# Altium project power.PrjPcb (part 2 of 3)
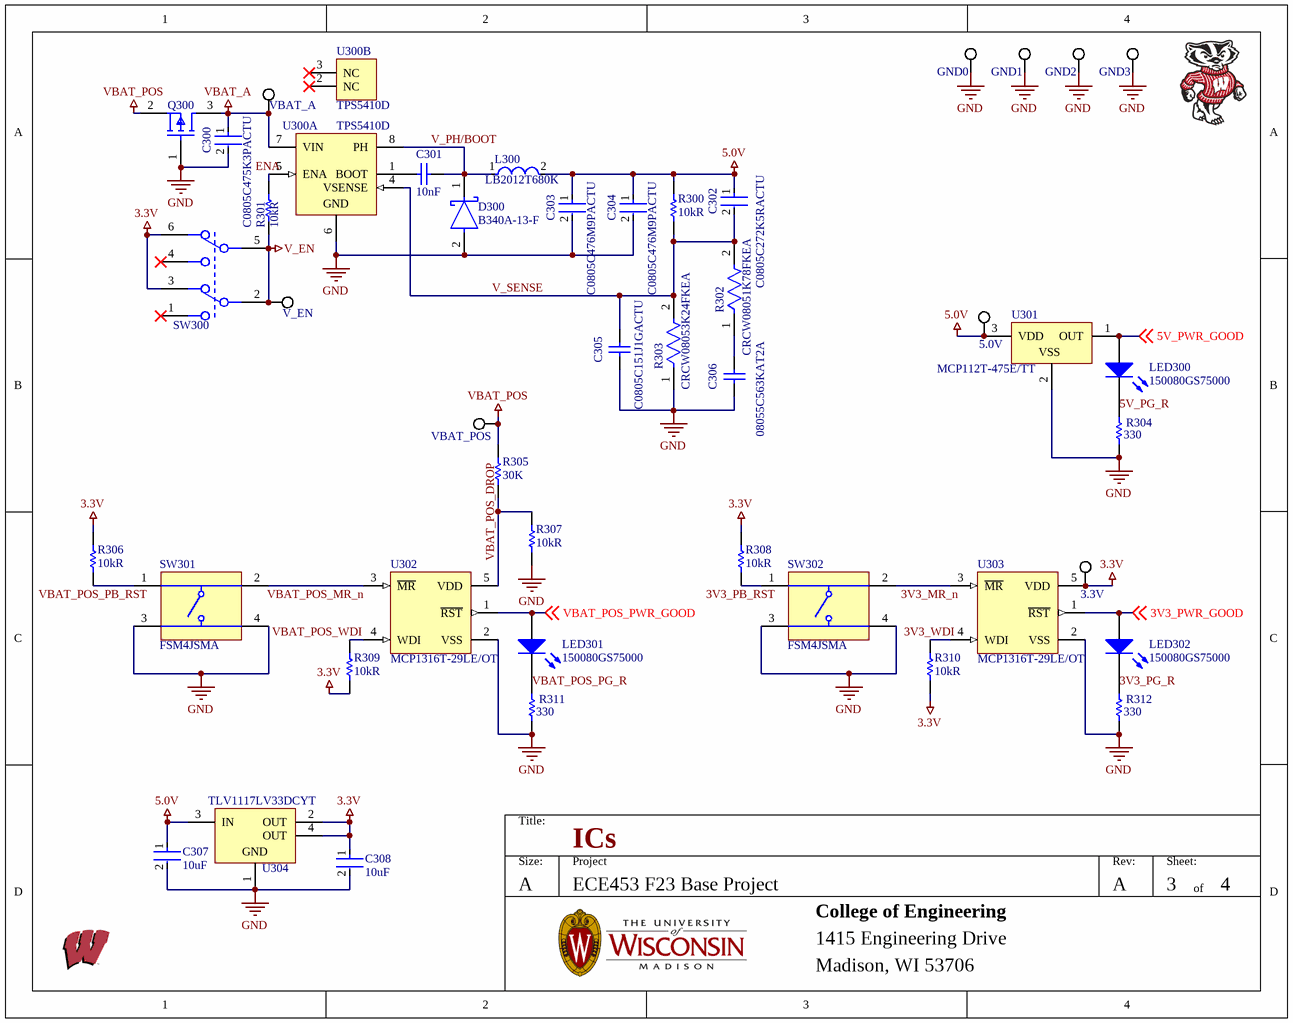
[diagram p3: 03_ICs.SchDoc]

## Sheet 03_ICs.SchDoc: ICs (continued)
### Library data of the parts
3.3V 5.0V GND0-GND3 V_EN VBAT_A VBAT_POS = CMP-1672-00008-1: Test Point, 1 Position SMD, RoHS, Tape and Reel; Manufacturer: Keystone Electronics; Plating: Silver; Body Material: Bronze; Supplier: Newark; Supplier Part Number: 59Y8500; Manufacturer Part Number: 5019; RoHS: Yes; Category: Connectors; Stock: 11269; Pricing: 1=0.411, 10=0.389, 25=0.285, 50=0.279, 100=0.273, 250=0.246 (USD); Mounting Technology: Surface Mount,PCB; Pins: 1; Contact Plating: Silver; Contact Material: Bronze; Material: Bronze; Packaging: Tape and Reel; Package Quantity: 1; Termination: SMD/SMT; Series: 5019; Height: 0.09inch; Reach SVHC Compliant: No; RoHS Compliant: Yes; Lead Free: Lead Free; ComponentLink1URL: https://datasheet.ciiva.com/14848/m60-2p61-14848437.pdf?src-supplier=Digi-Key; ComponentLink1Description: https://datasheet.ciiva.com/14848/m60-2p61-14848437.pdf?src-supplier=Digi-Key; ComponentLink2URL: https://datasheet.ciiva.com/14848/m60-2p61-14848438.pdf?src-supplier=Digi-Key; ComponentLink2Description: https://datasheet.ciiva.com/14848/m60-2p61-14848438.pdf?src-supplier=Digi-Key; ComponentLink3URL: https://datasheet.ciiva.com/14848/m60-2p61-14848439.pdf?src-supplier=Digi-Key; ComponentLink3Description: https://datasheet.ciiva.com/14848/m60-2p61-14848439.pdf?src-supplier=Digi-Key; ComponentLink4URL: https://datasheet.ciiva.com/16318/m60-2p61-16318395.pdf?src-supplier=Future+Electronics; ComponentLink4Description: https://datasheet.ciiva.com/16318/m60-2p61-16318395.pdf?src-supplier=Future+Electronics; ComponentLink5URL: https://datasheet.ciiva.com/16885/70182998-16885945.pdf?src-supplier=Allied+Electronics; ComponentLink5Description: https://datasheet.ciiva.com/16885/70182998-16885945.pdf?src-supplier=Allied+Electronics
C300 = CMP-2007-01010-2: CAP CER 4.7UF 25V X5R 0805; Manufacturer: KEMET; Tolerance: 10%; Dielectric Material: Ceramic; Dissipation Factor: 5%; Multilayer: Yes; Length: 2mm; Number of Pins: 2; Voltage Rating (DC): 25V; Depth: 1.25mm; Min Operating Temperature: -55°C; Capacitance: 4.7uF; Series: C0805C; Lead Free: Lead Free; Dielectric: X5R; REACH SVHC: No SVHC; Termination: SMD/SMT; Mount: PCB; Package Quantity: 2500; Contact Plating: Tin; Case Code (Imperial): 0805; Max Operating Temperature: 85°C; Width: 1.2mm; Voltage: 25V; Case/Package: 0805; Packaging: Tape and Reel; Height: 1.25mm; RoHS Compliant: Yes; Construction: Flat; Case Code (Metric): 2012; Radiation Hardening: No; Supplier: Digi-Key; Supplier Part Number: 399-C0805C475K3PAC7800CT-ND; Manufacturer Part Number: C0805C475K3PACTU; RoHS: Yes; Category: Ceramic Capacitors; Stock: 419470; Pricing: 1=0.29, 10=0.198, 50=0.1388, 100=0.1189, 500=0.0892, 1000=0.07533 (USD); Mounting Technology: Surface Mount; Pins: 2; Terminal Finish: Nickel; Package Shape: Rectangular; JESD-609 Code: e3; Value: 4.7uF; Capacitor Type: Ceramic; Tolerance  (fill in as +-): 10%; Package Style: SMTMeter; Tolerance (fill in as +-): 10%; Rated DC Voltage (URdc): 25V; Temperature Characteristics Code: X5R; Reach SVHC Compliant: Yes; ComponentLink1URL: https://datasheet.ciiva.com:443/pdfs/VipMasterIC/IC/KEME/KEME-S-A0008991665/KEME-S-A0008991665-1.pdf?src-supplier=IHS+Markit; ComponentLink1Description: https://datasheet.ciiva.com:443/pdfs/VipMasterIC/IC/KEME/KEME-S-A0008991665/KEME-S-A0008991665-1.pdf?src-supplier=IHS+Markit; ComponentLink2URL: https://datasheet.ciiva.com/7842/40889-7842614.pdf?src-supplier=Element14; ComponentLink2Description: https://datasheet.ciiva.com/7842/40889-7842614.pdf?src-supplier=Element14; ComponentLink3URL: https://datasheet.ciiva.com/22748/1918694-22748309.pdf?src-supplier=Element14; ComponentLink3Description: https://datasheet.ciiva.com/22748/1918694-22748309.pdf?src-supplier=Element14
C301 = Cap_4: Cap Ceramic 0.01uF 100V X7R 10% SMD 0805 125°C Plastic T/R; Manufacturer: KEMET; Manufacturer Part Number: C0805C103K1RAC7210; Supplier 1: Digi-Key; Supplier Part Number 1: 399-17617-1-ND; RoHS: Yes; Category: Ceramic Capacitors; Stock 1: 464939; Pricing 1: 1=0.10000, 10=0.05400, 50=0.02960, 100=0.02430, 500=0.01732, 1000=0.01361, 2500=0.01237, 5000=0.01138 (USD); Mounting Technology: Surface Mount; Case/Package: 0805; Case Code (Imperial): 0805; Case Code (Metric): 2012; Dielectric Material: Ceramic; Min Operating Temperature: -55°C; Max Operating Temperature: 125°C; Tolerance: 10%; Packaging: Tape and Reel; Package Quantity: 10000; Voltage Rating: 100V; Voltage Rating (DC): 100V; Dielectric: X7R; Termination: SMD/SMT; Series: C0805C; Construction: Flat; Length: 2mm; Height: 0.78mm; Depth: 1.25mm; Radiation Hardening: No; RoHS Compliant: Yes; ComponentLink1URL: http://www.farnell.com/datasheets/2747800.pdf?src-supplier=Farnell; ComponentLink1Description: http://www.farnell.com/datasheets/2747800.pdf?src-supplier=Farnell; ComponentLink2URL: http://www.mouser.com/ds/2/212/KEM_C1002_X7R_SMD-1102033.pdf?src-supplier=Mouser; ComponentLink2Description: http://www.mouser.com/ds/2/212/KEM_C1002_X7R_SMD-1102033.pdf?src-supplier=Mouser; ComponentLink3URL: http://components.arrow.com/part/dataview/2091052S6675795N7429?src-supplier=Arrow+Electronics; ComponentLink3Description: http://components.arrow.com/part/dataview/2091052S6675795N7429?src-supplier=Arrow+Electronics; ComponentLink4URL: https://www.verical.com/server-webapp/html/getDatasheet?partID=131027&src-supplier=Verical; ComponentLink4Description: https://www.verical.com/server-webapp/html/getDatasheet?partID=131027&src-supplier=Verical; ComponentLink5URL: http://www.kemet.com/kemet/web/homepage/kechome.nsf/weben/C4DA2DA1D1C9D3C3CA2570A50016092D/$file/KEM_C1002_X7R_SMD.pdf?src-supplier=Avnet; ComponentLink5Description: http://www.kemet.com/kemet/web/homepage/kechome.nsf/weben/C4DA2DA1D1C9D3C3CA2570A50016092D/$file/KEM_C1002_X7R_SMD.pdf?src-supplier=Avnet; ComponentLink6URL: https://api.kemet.com/component-edge/download/datasheet/C0805C103K1RAC7210.pdf?src-supplier=Digi-Key; ComponentLink6Description: https://api.kemet.com/component-edge/download/datasheet/C0805C103K1RAC7210.pdf?src-supplier=Digi-Key; ComponentLink7URL: http://www.farnell.com/datasheets/2747800.pdf?src-supplier=Newark; ComponentLink7Description: http://www.farnell.com/datasheets/2747800.pdf?src-supplier=Newark; ComponentLink8URL: http://www.kemet.com/kemet/web/homepage/kechome.nsf/weben/C4DA2DA1D1C9D3C3CA2570A50016092D/$file/KEM_C1002_X7R_SMD.pdf; ComponentLink8Description: http://www.kemet.com/kemet/web/homepage/kechome.nsf/weben/C4DA2DA1D1C9D3C3CA2570A50016092D/$file/KEM_C1002_X7R_SMD.pdf; Value: 10nF
C302 = CMP-2007-00354-2: 0805 C 2.7nF Ceramic Multilayer Capacitor; 50 VDC; +125degC; X7R Dielec; +/-10%; Manufacturer: KEMET; Voltage Rating: 50 V; Value: 2,700 pF; Tolerance: 0.1; Temperature Coefficient: 30ppm/°C; Multilayer: Yes; Tolerance  (fill in as +-): 10%; Rated DC Voltage (URdc): 50V; Temperature Characteristic: X7R; Digikey Description: 0805 C 2.7nF Ceramic Multilayer Capacitor; 50 VDC; +125degC; X7R Dielec; +/-10%; Device Class L3: Ceramic Capacitors; Height: 0.88mm; Manufacturer Part Number: C0805C272K5RACTU; Capacitance: 2,700 pF; Temperature: -55°C to +125°C; Mouser Description: 0805 C 2.7nF Ceramic Multilayer Capacitor; 50 VDC; +125degC; X7R Dielec; +/-10%; Automotive: No; Material: Ceramic; Octopart: https://octopart.com/c0805c272k5ractu-kemet-135930; ComponentLink2URL: https://content.kemet.com/datasheets/KEM_C1003_C0G_SMD.pdf; RoHS: TRUE; Device Class L2: Capacitors; Temperature Range High: +125°C; Device Class L1: Passive Components; Package: C0805C-DN; Ipc Land Pattern Name: CAPC200125X78; ComponentLink2Description: Datasheet; Lead Free: Yes; Temperature Range Low: -55°C; Category: Cap; Supplier: Digi-Key; Supplier Part Number: 399-C0805C272K5RAC7800CT-ND; Stock: 22544; Pricing: 1=0.16, 10=0.108, 50=0.0648, 100=0.0547, 500=0.03744, 1000=0.03312 (USD); Mounting Technology: Surface Mount; Pins: 2; Dielectric Material: Ceramic; Package Shape: Rectangular; Case/Package: 0805; Terminal Finish: Nickel; Min Operating Temperature: -55°C; Max Operating Temperature: 125°C; JESD-609 Code: e3; Capacitor Type: Ceramic; Packaging: Tape and Reel; Tolerance (fill in as +-): 10%; Temperature Characteristics Code: X7R; Termination: Wraparound; Manufacturer Series: C0805C272K5RACTU; Reach SVHC Compliant: Yes; RoHS Compliant: Yes; ComponentLink1URL: http://capacitoredge.kemet.com:80/capedge2/DataSheet/Datasheet-C0805C272K5RAC7800.pdf?pn=C0805C272K5RAC7800&src-supplier=IHS+Markit; ComponentLink1Description: http://capacitoredge.kemet.com:80/capedge2/DataSheet/Datasheet-C0805C272K5RAC7800.pdf?pn=C0805C272K5RAC7800&src-supplier=IHS+Markit; ComponentLink3URL: https://datasheet.ciiva.com/14589/70095383-14589404.pdf?src-supplier=Allied+Electronics; ComponentLink3Description: https://datasheet.ciiva.com/14589/70095383-14589404.pdf?src-supplier=Allied+Electronics
C303 C304 = CMP-2007-01008-2: CAP CER 47UF 6.3V X5R 0805; Manufacturer: KEMET; Dielectric Material: Ceramic; Dissipation Factor: 5%; Tolerance: 20%; Multilayer: Yes; Case Code (Imperial): 0805; Mount: PCB; Width: 1.2mm; Package Quantity: 3000; Radiation Hardening: No; Packaging: Tape and Reel; Termination: SMD/SMT; Series: C0805C; Voltage: 6.3V; Depth: 1.25mm; Dielectric: X5R; Case Code (Metric): 2012; Length: 2mm; Case/Package: 0805; REACH SVHC: No SVHC; Voltage Rating (DC): 6.3V; Capacitance: 47uF; RoHS Compliant: Yes; Height: 1.25mm; Construction: Flat; Number of Pins: 2; Voltage Rating: 6.3V; Max Operating Temperature: 85°C; Min Operating Temperature: -55°C; Supplier: Digi-Key; Supplier Part Number: 399-C0805C476M9PAC7800CT-ND; Manufacturer Part Number: C0805C476M9PACTU; RoHS: Yes; Category: Ceramic Capacitors; Stock: 80632; Pricing: 1=0.78, 10=0.597, 50=0.4956, 100=0.4268, 500=0.3304, 1000=0.28451 (USD); Mounting Technology: Surface Mount; Pins: 2; Package Shape: Rectangular; Terminal Finish: Nickel; JESD-609 Code: e3; Value: 47uF; Capacitor Type: Ceramic; Tolerance  (fill in as +-): 20%; Package Style: SMTMeter; Tolerance (fill in as +-): 20%; Rated DC Voltage (URdc): 6.3V; Temperature Characteristics Code: X5R; Reach SVHC Compliant: Yes; ComponentLink1URL: https://datasheet.ciiva.com:443/pdfs/VipMasterIC/IC/KEME/KEME-S-A0008991665/KEME-S-A0008991665-1.pdf?src-supplier=IHS+Markit; ComponentLink1Description: https://datasheet.ciiva.com:443/pdfs/VipMasterIC/IC/KEME/KEME-S-A0008991665/KEME-S-A0008991665-1.pdf?src-supplier=IHS+Markit; ComponentLink2URL: https://datasheet.ciiva.com/6137/40889-6137142.pdf?src-supplier=Farnell; ComponentLink2Description: https://datasheet.ciiva.com/6137/40889-6137142.pdf?src-supplier=Farnell; ComponentLink3URL: https://datasheet.ciiva.com/7842/40889-7842618.pdf?src-supplier=Element14; ComponentLink3Description: https://datasheet.ciiva.com/7842/40889-7842618.pdf?src-supplier=Element14
C305 = CMP-2007-00291-1: Manufacturer: Kemet; Dielectric Material: Ceramic; Value: 150pF; Multilayer: Yes; Tolerance  (fill in as +-): 5%; Rated DC Voltage (URdc): 100V; Temperature Characteristics Code: C0G; Part Number: C0805C151J1GACTU; Supplier: Digi-Key; Supplier Part Number: 399-C0805C151J1GAC7800CT-ND; Manufacturer Part Number: C0805C151J1GACTU; RoHS: Yes; Category: Ceramic Capacitors; Stock: 29603; Pricing: 1=0.26, 10=0.18, 50=0.1202, 100=0.1022, 500=0.07212, 1000=0.0631 (USD); Mounting Technology: Surface Mount; Pins: 2; Case/Package: 0805; Terminal Finish: Nickel; Package Shape: Rectangular; Min Operating Temperature: -55°C; Max Operating Temperature: 125°C; JESD-609 Code: e3; Capacitor Type: Ceramic; Packaging: Tape and Reel; Tolerance (fill in as +-): 5%; Termination: Wraparound; Manufacturer Series: C0805C151J1GACTU; Reach SVHC Compliant: Yes; RoHS Compliant: Yes; ComponentLink1URL: https://datasheet.ciiva.com:443/pdfs/VipMasterIC/IC/KEME/KEME-S-A0000339992/KEME-S-A0000339992-1.pdf?src-supplier=IHS+Markit; ComponentLink1Description: https://datasheet.ciiva.com:443/pdfs/VipMasterIC/IC/KEME/KEME-S-A0000339992/KEME-S-A0000339992-1.pdf?src-supplier=IHS+Markit; ComponentLink2URL: https://datasheet.ciiva.com/22752/1907778-22752185.pdf?src-supplier=Element14; ComponentLink2Description: https://datasheet.ciiva.com/22752/1907778-22752185.pdf?src-supplier=Element14; ComponentLink3URL: https://datasheet.ciiva.com/18193/getdatasheetpartid-330695-18193563.pdf?src-supplier=Verical; ComponentLink3Description: https://datasheet.ciiva.com/18193/getdatasheetpartid-330695-18193563.pdf?src-supplier=Verical
C306 = CMP-2007-04436-1: Manufacturer: AVX Interconnect / Elco; Dielectric Material: Ceramic; Value: 56nF; Multilayer: Yes; Tolerance  (fill in as +-): 10%; Rated DC Voltage (URdc): 50V; Temperature Characteristics Code: X7R; Part Number: 08055C563KAT2A; Supplier: Digi-Key; Supplier Part Number: 478-1392-1-ND; Manufacturer Part Number: 08055C563KAT2A; RoHS: Yes; Category: Ceramic Capacitors; Stock: 29440; Pricing: 1=0.12, 10=0.089, 50=0.0504, 100=0.0418, 500=0.02928, 1000=0.02424 (USD); Mounting Technology: Surface Mount; Pins: 2; Package Shape: Rectangular; Case/Package: 0805; Terminal Finish: Nickel; Min Operating Temperature: -55°C; Max Operating Temperature: 125°C; Capacitor Type: Ceramic; JESD-609 Code: e3; Package Style: SMTMeter; Packaging: Tape and Reel; Tolerance (fill in as +-): 10%; Termination: Wraparound; Length: 2.01mm; Width: 1.25mm; Height: 0.94mm; Reach SVHC Compliant: Yes; RoHS Compliant: Yes; ComponentLink1URL: https://datasheet.ciiva.com:443/pdfs/VipMasterIC/IC/AVXC/AVXC-S-A0008668650/AVXC-S-A0008668650-1.pdf?src-supplier=IHS+Markit; ComponentLink1Description: https://datasheet.ciiva.com:443/pdfs/VipMasterIC/IC/AVXC/AVXC-S-A0008668650/AVXC-S-A0008668650-1.pdf?src-supplier=IHS+Markit; ComponentLink2URL: https://datasheet.ciiva.com/19476/1036591-19476553.pdf?src-supplier=Jameco; ComponentLink2Description: https://datasheet.ciiva.com/19476/1036591-19476553.pdf?src-supplier=Jameco; ComponentLink3URL: https://datasheet.ciiva.com/11787/0900766b80dc2409-11787766.pdf?src-supplier=Rs; ComponentLink3Description: https://datasheet.ciiva.com/11787/0900766b80dc2409-11787766.pdf?src-supplier=Rs; ComponentLink4URL: https://datasheet.ciiva.com/150/cx7r-150632.pdf?src-supplier=Digi-Key; ComponentLink4Description: https://datasheet.ciiva.com/150/cx7r-150632.pdf?src-supplier=Digi-Key; ComponentLink5URL: https://datasheet.ciiva.com/150/cx7r-150633.pdf?src-supplier=Digi-Key; ComponentLink5Description: https://datasheet.ciiva.com/150/cx7r-150633.pdf?src-supplier=Digi-Key; ComponentLink6URL: https://datasheet.ciiva.com/150/cx7r-150634.pdf?src-supplier=Digi-Key; ComponentLink6Description: https://datasheet.ciiva.com/150/cx7r-150634.pdf?src-supplier=Digi-Key; ComponentLink7URL: https://datasheet.ciiva.com/5412/cx7r-5412810.pdf?src-supplier=Mouser; ComponentLink7Description: https://datasheet.ciiva.com/5412/cx7r-5412810.pdf?src-supplier=Mouser; ComponentLink8URL: https://datasheet.ciiva.com/16326/cx7r-16326391.pdf?src-supplier=Future+Electronics; ComponentLink8Description: https://datasheet.ciiva.com/16326/cx7r-16326391.pdf?src-supplier=Future+Electronics; ComponentLink9URL: https://datasheet.ciiva.com/28535/1818074-28535102.pdf?src-supplier=Element14; ComponentLink9Description: https://datasheet.ciiva.com/28535/1818074-28535102.pdf?src-supplier=Element14
C307 C308 = CMP-2007-03243-2: CAP CER 10UF 10V X5R 0805; Manufacturer: KEMET; Dielectric Material: Ceramic; Tolerance: 10%; Supplier: Newark; Supplier Part Number: 70K9138; Manufacturer Part Number: C0805C106K8PACTU; RoHS: Yes; Category: Ceramic Capacitors; Stock: 186414; Pricing: 1=0.141, 25=0.141, 50=0.141, 100=0.141, 250=0.141, 500=0.141, 1000=0.141 (USD); Mounting Technology: Surface Mount; Case/Package: 0805; Pins: 2; Contact Plating: Tin,Matte; Case Code (Imperial): 0805; Case Code (Metric): 2012; Min Operating Temperature: -55°C; Max Operating Temperature: 85°C; Packaging: Tape and Reel; Dielectric: X5R; Voltage Rating (DC): 10V; Termination: SMD/SMT; Package Quantity: 1; Voltage Rating: 10V; Voltage: 10V; Dissipation Factor: 10%; Series: C; Construction: Flat; Length: 2mm; Width: 0.049inch; Height: 1.25mm; Depth: 1.25mm; Thickness: 0.055inch; Radiation Hardening: No; Reach SVHC Compliant: No; RoHS Compliant: Yes; ComponentLink1URL: https://datasheet.ciiva.com/7842/1732709-7842198.pdf?src-supplier=Element14; ComponentLink1Description: https://datasheet.ciiva.com/7842/1732709-7842198.pdf?src-supplier=Element14
D300 = CMP-1667-00003-3: DIODE SCHOTTKY 40V 3A SMA; Manufacturer: Diodes; Max Forward Surge Current (Ifsm): 80A; Forward Voltage: 500mV; Polarity: Standard; Max Reverse Current: 500uA; Capacitance: 250pF; Element Configuration: Single; Package Body Material: Plastic; Diode Element Material: SILICON; Diode Type: RECTIFIER; Time @ Peak Reflow Temperature-Max (s): 40s; Application(s): EFFICIENCY; Number of Elements: 1; Reference Standard: AEC-Q101; Qualification Status: Not Qualified; Mount: Surface Mount; Output Current: 3A; Radiation Hardening: No; Width: 2.92mm; Current Rating: 3A; Termination: SMD/SMT; Voltage: 40V; Series: -; Max Operating Temperature: 125°C; Current: 3A; Max Repetitive Reverse Voltage (Vrrm): 40V; Min Operating Temperature: -55°C; REACH SVHC: No SVHC; Number of Pins: 2; Average Rectified Current: 3A; Contact Plating: Tin; RoHS Compliant: Yes; Max Reverse Voltage (DC): 40V; Packaging: Tape and Reel; Height: 2.3mm; Length: 4.6mm; Case/Package: SMA; Weight: 0.002258oz; Peak Non-Repetitive Surge Current: 80A; Package Quantity: 5000; Lead Free: Lead Free; Forward Current: 3A; Voltage Rating (DC): 40V; Supplier: Digi-Key; Supplier Part Number: B340A-FDICT-ND; Manufacturer Part Number: B340A-13-F; RoHS: Yes; Category: Rectifier Diodes; Stock: 42803; Pricing: 1=0.43, 10=0.334, 100=0.2004, 500=0.18558, 1000=0.1262, 2000=0.11618 (USD); Pins: 2; Terminal Finish: Tin; Package Shape: Rectangular; JESD-609 Code: e3; JESD-30 Code: R-PDSO-C2; Max Output current: 3A; Package Style: SMALL OUTLINEMeter; Surface Mount: Yes; Technology: SCHOTTKY; Terminal Form: C BEND; Terminal Position: DUAL; Moisture Sensitivity Level: 1; Peak Reflow Temperature (Cel): 260°C; Non-rep Pk Forward Current-Max: 80A; Number of Phases: 1; Rep Pk Reverse Voltage-Max: 40V; Reach SVHC Compliant: No; ComponentLink1URL: https://datasheet.ciiva.com:443/pdfs/VipMasterIC/IC/DIOD/DIOD-S-A0002833665/DIOD-S-A0002833511-1.pdf?src-supplier=IHS+Markit; ComponentLink1Description: https://datasheet.ciiva.com:443/pdfs/VipMasterIC/IC/DIOD/DIOD-S-A0002833665/DIOD-S-A0002833511-1.pdf?src-supplier=IHS+Markit
L300 = CMP-14484-000451-1: SMD Inductors 68uH ±10% 0.05A 7.8Ω 0805; Manufacturer: Taiyo Yuden; Max DC Current: 50mA; Test Frequency: 2.52MHz; Core Material: Ferrite; Shielding: Unshielded; Self Resonant Frequency: 10MHz; DC Resistance (DCR): 6R; Case/Size Code: 0805; Inductor Type: GENERAL PURPOSE INDUCTOR; Channels: 1; Shape/Size Description: RECTANGULAR PACKAGE; Inductor Application: RF INDUCTOR; Package Height: 1.25mm; Package Length: 2mm; Termination: SMD/SMT; Lead Free: Lead Free; Radiation Hardening: No; Height: 1.25mm; Military Standard: Not; Min Operating Temperature: -40°C; Tolerance: 10%; Mount: Surface Mount; Packaging: Tape and Reel; Number of Pins: 2; Current Rating: 50mA; Case Code (Metric): 2012; Inductance: 68uH; Length: 0.079inch; Case/Package: 0805; Depth: 1.45mm; RoHS Compliant: Yes; Halogen Free: Halogen Free; Series: LB; Case Code (Imperial): 0805; Max Operating Temperature: 105°C; Height - Seated (Max): 0.057inch; Package Quantity: 1; DC Current: 50mA; Resistor Type: Wirewound; Width: 1.25mm; Supplier: Digi-Key; Supplier Part Number: 587-2450-1-ND; Manufacturer Part Number: LB2012T680K; RoHS: Yes; Category: Fixed Inductors; Stock: 7601; Pricing: 1=0.14, 10=0.125, 25=0.1064, 50=0.094, 100=0.0861, 250=0.07828, 500=0.07358, 1000=0.05636 (USD); Pins: 2; Terminal Finish: Tin; Inductance-Nom (L): 68uH; Max Current Rating: 50mA; Surface Mount: Yes; Terminal Placement: Dual Ended; Construction: Chip; Package Style: SMTMeter; JESD-609 Code: e3; Package Width: 1.25mm; Reach SVHC Compliant: Yes; ComponentLink1URL: https://datasheet.ciiva.com:443/pdfs/VipMasterIC/IC/TAIY/TAIY-S-A0009098652/TAIY-S-A0009098837-1.pdf?src-supplier=IHS+Markit; ComponentLink1Description: https://datasheet.ciiva.com:443/pdfs/VipMasterIC/IC/TAIY/TAIY-S-A0009098652/TAIY-S-A0009098837-1.pdf?src-supplier=IHS+Markit; ComponentLink2URL: https://datasheet.ciiva.com/1039/lb2012t680k-ss-1039309.pdf?src-supplier=Digi-Key; ComponentLink2Description: https://datasheet.ciiva.com/1039/lb2012t680k-ss-1039309.pdf?src-supplier=Digi-Key; ComponentLink3URL: https://datasheet.ciiva.com/26872/getdatasheetpartid-637266-26872144.pdf?src-supplier=Verical; ComponentLink3Description: https://datasheet.ciiva.com/26872/getdatasheetpartid-637266-26872144.pdf?src-supplier=Verical
LED300-LED302 = CMP-1426-00007-1: SMD mono-color Chip LED, WL-SMCW, Green; Manufacturer: Wuerth Elektronik; Manufacturer 1: Wurth Electronics; Viewing Angle: 140°; Lens Style: Clear,Rectangular; Luminous Intensity: 450mcd; Forward Voltage: 3.2V; Wavelength: 520nm; Forward Current: 30mA; Test Current: 20mA; Lens Color: Colorless; Lens Transparency: Clear; Lens Size: 1.25mm; PackageReference: 0805_A; Color: Green; PartNumber: 150080GS75000; ComponentLink2URL: http://katalog.we-online.com/led/datasheet/150080GS75000.pdf; ComponentLink1URL: http://www.we-online.com; ComponentLink1Description: Manufacturer URL; ComponentLink2Description: Datasheet; Supplier 1: Digi-Key; Supplier Part Number 1: 732-4983-1-ND; Manufacturer Part Number 1: 150080GS75000; RoHS: Yes; Category: LEDs; Stock 1: 95801; Pricing 1: 1=0.19000, 50=0.17600, 100=0.15100, 500=0.13100 (USD); Mount: Surface Mount; Case/Package: 0805; Case Code (Metric): 2012; Case Code (Imperial): 0805; Min Operating Temperature: -40°C; Max Operating Temperature: 85°C; Package Quantity: 4000; Packaging: Cut Tape; Dominant Wavelength: 520nm; Length: 2mm; Width: 1.25mm; Height: 0.7mm; REACH SVHC: Unknown; RoHS Compliant: Yes; ComponentLink3URL: https://datasheet.ciiva.com/29563/150080gs75000-29563008.pdf?src-supplier=Digi-Key; ComponentLink3Description: https://datasheet.ciiva.com/29563/150080gs75000-29563008.pdf?src-supplier=Digi-Key; ComponentLink4URL: https://datasheet.ciiva.com/29279/759434-da-01-en-chipled-0805-w-kl-gruen-150080gs75000-29279039.pdf?src-supplier=Conrad; ComponentLink4Description: https://datasheet.ciiva.com/29279/759434-da-01-en-chipled-0805-w-kl-gruen-150080gs75000-29279039.pdf?src-supplier=Conrad; Supplier: Newark; Supplier Part Number: 95W3800; Manufacturer Part Number: 150080GS75000; Stock: 59977; Pricing: 1=0.194, 5=0.194, 10=0.191, 25=0.186, 50=0.18, 100=0.154, 500=0.141 (USD); Mounting Technology: Surface Mount; Series: WL-SMCW; Reach SVHC Compliant: Unknown
Q300 = SSM3J328R,LF: MOSFET P-CH 20V 6A SOT23F; Manufacturer 1: Toshiba; Rds On Max: 29.8mR; Input Capacitance: 840pF; Max Power Dissipation: 1W; Gate to Source Voltage (Vgs): 8V; Turn-Off Delay Time: 107ns; Turn-On Delay Time: 32ns; Number of Channels: 1; Drain to Source Resistance: 47.4mR; Power Dissipation: 2W; Element Configuration: Single; Drain to Source Breakdown Voltage: -20V; Polarity: P-CHANNEL; Supplier 1: Digi-Key; Supplier Part Number 1: SSM3J328RLFCT-ND; Manufacturer Part Number 1: SSM3J328R,LF; RoHS: Yes; Category: MOSFETs; Stock 1: 476474; Pricing 1: 1=0.43000, 10=0.32200, 25=0.29040, 100=0.20060, 500=0.13728, 1000=0.10560 (USD); Mount: Surface Mount; Case/Package: SOT-23-3; Number of Pins: 3; Min Operating Temperature: -55°C; Max Operating Temperature: 150°C; Package Quantity: 3000; Packaging: Tape and Reel; Drain to Source Voltage (Vdss): 20V; Continuous Drain Current (ID): 6A; Number of Elements: 1; Radiation Hardening: No; RoHS Compliant: Yes; ComponentLink1URL: https://datasheet.ciiva.com/11158/ssm3j328r-datasheet-en-20140301-11158652.pdf?src-supplier=Avnet; ComponentLink1Description: https://datasheet.ciiva.com/11158/ssm3j328r-datasheet-en-20140301-11158652.pdf?src-supplier=Avnet; ComponentLink2URL: https://datasheet.ciiva.com/24106/ssm3j328r-datasheet-en-20140301-24106699.pdf?src-supplier=Mouser; ComponentLink2Description: https://datasheet.ciiva.com/24106/ssm3j328r-datasheet-en-20140301-24106699.pdf?src-supplier=Mouser; ComponentLink3URL: https://datasheet.ciiva.com/45425/ssm3j328r-datasheet-en-20140301-45425519.pdf?src-supplier=Digi-Key; ComponentLink3Description: https://datasheet.ciiva.com/45425/ssm3j328r-datasheet-en-20140301-45425519.pdf?src-supplier=Digi-Key; ComponentLink4URL: https://datasheet.ciiva.com/45425/ssm3j328r-datasheet-en-20140301-45425813.pdf?src-supplier=Digi-Key; ComponentLink4Description: https://datasheet.ciiva.com/45425/ssm3j328r-datasheet-en-20140301-45425813.pdf?src-supplier=Digi-Key
R300 R301 R306-R310 = CMP-1659-00013-4: Chip Resistor, 10 KOhm, +/- 1%, 0.125 W, -55 to 155 degC, 0805 (2012 Metric), RoHS, Tape and Reel; Manufacturer: Yageo; Voltage Rating: 150 V; Temperature Coefficient: 100ppm/°C; Power Rating: 125mW; Value: 10kR; Mount: Surface Mount; ComponentLink1Description: Manufacturer URL; ComponentLink2URL: http://www.yageo.com/documents/recent/PYu-RC_Group_51_RoHS_L_04.pdf; Pins: 2; Length: 2 mm; Min Operating Temperature: -55 degC; Height: 0.5 mm; Mounting Technology: Surface Mount; RoHSCompliant: true; REACH SVHC: No SVHC; ComponentLink1URL: http://www.yageo.com/; Max Operating Temperature: 155 degC; PackageReference: 0805; DatasheetVersion: Rev. 4, 02/2016; Package Quantity: 5000; Packaging: Tape and Reel; ComponentLink2Description: Datasheet; PackageDescription: 2-Pin Surface Mounted Device, Body 2 x 1.25 mm; Supplier 1: Digi-Key; Supplier Part Number 1: 311-10.0KCRCT-ND; Manufacturer 1: Yageo; Manufacturer Part Number 1: RC0805FR-0710KL; RoHS: Yes; Category: Chip SMD Resistors; Stock 1: 5682818; Pricing 1: 1=0.10000, 10=0.03800, 100=0.01560, 1000=0.00702, 2500=0.00610 (USD); Case/Package: 0805; Case Code (Imperial): 0805; Case Code (Metric): 2012; Size Code: 0805; Tolerance: 1%; Resistor Type: Thick Film; Series: RC; Number of Terminations: 2; Max Power Dissipation: 125mW; Termination: SMD/SMT; Features: Moisture Resistant; Construction: Rectangular; Resistance Tolerance: 1%; Technology: THICK FILM; Width: 0.049inch; Depth: 1.25mm; RoHS Compliant: Yes; Military Standard: Not; Lead Free: Lead Free; ComponentLink3URL: https://datasheet.ciiva.com/11808/0900766b8106beab-11808151.pdf?src-supplier=RSComponents; ComponentLink3Description: https://datasheet.ciiva.com/11808/0900766b8106beab-11808151.pdf?src-supplier=RSComponents; ComponentLink4URL: https://datasheet.ciiva.com/46447/444164-46447563.pdf?src-supplier=Element14; ComponentLink4Description: https://datasheet.ciiva.com/46447/444164-46447563.pdf?src-supplier=Element14; ComponentLink5URL: https://datasheet.ciiva.com/2456/pyu-r-int-thick-7-2456973.pdf?src-supplier=Digi-Key; ComponentLink5Description: https://datasheet.ciiva.com/2456/pyu-r-int-thick-7-2456973.pdf?src-supplier=Digi-Key; ComponentLink6URL: https://datasheet.ciiva.com/2456/pyu-r-int-thick-7-2456974.pdf?src-supplier=Digi-Key; ComponentLink6Description: https://datasheet.ciiva.com/2456/pyu-r-int-thick-7-2456974.pdf?src-supplier=Digi-Key; ComponentLink7URL: https://datasheet.ciiva.com/2456/pyu-r-int-thick-7-2456972.pdf?src-supplier=Digi-Key; ComponentLink7Description: https://datasheet.ciiva.com/2456/pyu-r-int-thick-7-2456972.pdf?src-supplier=Digi-Key; ComponentLink8URL: https://datasheet.ciiva.com/12669/rc0805-12669688.pdf?src-supplier=Mouser; ComponentLink8Description: https://datasheet.ciiva.com/12669/rc0805-12669688.pdf?src-supplier=Mouser; ComponentLink9URL: https://datasheet.ciiva.com/16747/rc0805-16747087.pdf?src-supplier=Future+Electronics; ComponentLink9Description: https://datasheet.ciiva.com/16747/rc0805-16747087.pdf?src-supplier=Future+Electronics; Supplier: Newark; Supplier Part Number: 05M4535; Manufacturer Part Number: RC0805FR-0710KL; Stock: 346650; Pricing: 1=0.102, 10=0.035, 25=0.028, 50=0.021, 100=0.014 (USD); Reach SVHC Compliant: Unknown; ComponentLink10URL: https://datasheet.ciiva.com/11808/0900766b8106beab-11808151.pdf?src-supplier=Rs; ComponentLink10Description: https://datasheet.ciiva.com/11808/0900766b8106beab-11808151.pdf?src-supplier=Rs
R302 = CMP-2001-03622-2: RES Thick Film, 1.78kΩ, 1%, 0.125W, 100ppm/°C, 0805; Manufacturer: Vishay; Voltage Rating: 150V; Max Power Dissipation: 125mW; Resistance: 1.78kR; Rated Temperature: 70°C; Value: 1.78kR; Package Height: 0.45mm; Package Length: 2mm; Package Width: 1.25mm; Reference Standard: AEC-Q200; Min Operating Temperature: -55°C; Composition: Thick Film; Depth: 1.25mm; Features: Automotive AEC-Q200; Width: 0.049inch; Max Operating Temperature: 155°C; Lead Free: Lead Free; Weight: 0.000194oz; Height: 0.45mm; Temperature Coefficient: 100ppm/°C; Contact Plating: Tin; Radiation Hardening: No; Packaging: Tape and Reel; Voltage Rating (DC): 150V; Case Code (Metric): 2012; Case/Package: 0805; Package Quantity: 10; Length: 2mm; Power Rating: 125mW; Military Standard: Not; Number of Terminations: 2; Case Code (Imperial): 0805; Tolerance: 1%; Termination: SMD/SMT; Number of Pins: 2; Supplier: Digi-Key; Supplier Part Number: 541-1.78KCCT-ND; Manufacturer Part Number: CRCW08051K78FKEA; RoHS: Yes; Category: Chip SMD Resistors; Stock: 14356; Pricing: 1=0.1, 10=0.038, 50=0.0244, 100=0.0206, 500=0.01434, 1000=0.01248 (USD); Mounting Technology: Surface Mount; Pins: 2; Package Shape: Rectangular; Terminal Finish: Nickel; Resistor Type: FIXED RESISTOR; Power: 125mW; Technology: METAL GLAZE/THICK FILM; Working Voltage: 150V; Construction: Chip; Package Style: SMTMeter; JESD-609 Code: e3; RoHS Compliant: Yes; Reach SVHC Compliant: Yes; ComponentLink1URL: https://datasheet.ciiva.com:443/pdfs/VipMasterIC/IC/VISH/VISH-S-A0007266705/VISH-S-A0007266705-1.pdf?src-supplier=IHS+Markit; ComponentLink1Description: https://datasheet.ciiva.com:443/pdfs/VipMasterIC/IC/VISH/VISH-S-A0007266705/VISH-S-A0007266705-1.pdf?src-supplier=IHS+Markit; ComponentLink2URL: https://datasheet.ciiva.com/11810/0900766b80d98b26-11810169.pdf?src-supplier=Rs; ComponentLink2Description: https://datasheet.ciiva.com/11810/0900766b80d98b26-11810169.pdf?src-supplier=Rs; ComponentLink3URL: https://datasheet.ciiva.com/2496/dcrcwe3-2496177.pdf?src-supplier=Digi-Key; ComponentLink3Description: https://datasheet.ciiva.com/2496/dcrcwe3-2496177.pdf?src-supplier=Digi-Key; ComponentLink4URL: https://datasheet.ciiva.com/2496/dcrcwe3-2496175.pdf?src-supplier=Digi-Key; ComponentLink4Description: https://datasheet.ciiva.com/2496/dcrcwe3-2496175.pdf?src-supplier=Digi-Key; ComponentLink5URL: https://datasheet.ciiva.com/3258/dcrcwe3-3258267.pdf?src-supplier=Avnet; ComponentLink5Description: https://datasheet.ciiva.com/3258/dcrcwe3-3258267.pdf?src-supplier=Avnet; ComponentLink6URL: https://datasheet.ciiva.com/3258/dcrcwe3-3258268.pdf?src-supplier=Avnet; ComponentLink6Description: https://datasheet.ciiva.com/3258/dcrcwe3-3258268.pdf?src-supplier=Avnet; ComponentLink7URL: https://datasheet.ciiva.com/16395/dcrcwe3-16395386.pdf?src-supplier=Future+Electronics; ComponentLink7Description: https://datasheet.ciiva.com/16395/dcrcwe3-16395386.pdf?src-supplier=Future+Electronics; ComponentLink8URL: https://datasheet.ciiva.com/16774/70201119-16774782.pdf?src-supplier=Allied+Electronics; ComponentLink8Description: https://datasheet.ciiva.com/16774/70201119-16774782.pdf?src-supplier=Allied+Electronics; ComponentLink9URL: https://datasheet.ciiva.com/22702/1697337-22702743.pdf?src-supplier=Element14; ComponentLink9Description: https://datasheet.ciiva.com/22702/1697337-22702743.pdf?src-supplier=Element14; ComponentLink10URL: https://datasheet.ciiva.com/22675/1847332-22675193.pdf?src-supplier=Element14; ComponentLink10Description: https://datasheet.ciiva.com/22675/1847332-22675193.pdf?src-supplier=Element14; ComponentLink11URL: https://datasheet.ciiva.com/5541/dcrcwe3-109170-5541990.pdf?src-supplier=Mouser; ComponentLink11Description: https://datasheet.ciiva.com/5541/dcrcwe3-109170-5541990.pdf?src-supplier=Mouser; ComponentLink12URL: https://datasheet.ciiva.com/2496/dcrcwe3-2496176.pdf?src-supplier=Digi-Key; ComponentLink12Description: https://datasheet.ciiva.com/2496/dcrcwe3-2496176.pdf?src-supplier=Digi-Key
R303 = CMP-2001-03875-2: RES Thick Film, 3.24kΩ, 1%, 0.125W, 100ppm/°C, 0805; Manufacturer: Vishay; Power Rating: 125mW; Voltage Rating: 150V; Resistance: 3.24kR; Value: 3.24kR; Rated Temperature: 70°C; Package Height: 0.45mm; Package Length: 2mm; Package Width: 1.25mm; Reference Standard: AEC-Q200; Case/Package: 0805; Case Code (Metric): 2012; Weight: 0.000194oz; Resistor Type: Thick Film; Number of Pins: 2; Max Operating Temperature: 155°C; Temperature Coefficient: 100ppm/°C; Lead Free: Lead Free; Technology: THICK FILM; Termination: Solder; RoHS Compliant: Yes; Min Operating Temperature: -55°C; Package Quantity: 10; Packaging: Tape and Reel; Resistance Tolerance: 1%; Contact Plating: Tin; Depth: 1.25mm; Size Code: 0805; Case Code (Imperial): 0805; Features: Automotive AEC-Q200; Max Power Dissipation: 125mW; Military Standard: Not; Tolerance: 1%; Height: 0.02inch; Width: 1.25mm; Length: 2mm; Number of Terminations: 2; Construction: Rectangular; Voltage Rating (DC): 150V; Series: CRCW; Radiation Hardening: No; Supplier: Digi-Key; Supplier Part Number: 541-3.24KCCT-ND; Manufacturer Part Number: CRCW08053K24FKEA; RoHS: Yes; Category: Chip SMD Resistors; Stock: 14960; Pricing: 1=0.1, 10=0.038, 50=0.0244, 100=0.0206, 500=0.01434, 1000=0.01248 (USD); Mounting Technology: Surface Mount; Pins: 2; Package Shape: Rectangular; Terminal Finish: Nickel; Power: 125mW; Working Voltage: 150V; Package Style: SMTMeter; JESD-609 Code: e3; Reach SVHC Compliant: Yes; ComponentLink1URL: https://datasheet.ciiva.com:443/pdfs/VipMasterIC/IC/VISH/VISH-S-A0007266705/VISH-S-A0007266705-1.pdf?src-supplier=IHS+Markit; ComponentLink1Description: https://datasheet.ciiva.com:443/pdfs/VipMasterIC/IC/VISH/VISH-S-A0007266705/VISH-S-A0007266705-1.pdf?src-supplier=IHS+Markit; ComponentLink2URL: https://datasheet.ciiva.com/16783/70201119-16783896.pdf?src-supplier=Allied+Electronics; ComponentLink2Description: https://datasheet.ciiva.com/16783/70201119-16783896.pdf?src-supplier=Allied+Electronics; ComponentLink3URL: https://datasheet.ciiva.com/7670/1697337-7670300.pdf?src-supplier=Element14; ComponentLink3Description: https://datasheet.ciiva.com/7670/1697337-7670300.pdf?src-supplier=Element14; ComponentLink4URL: https://datasheet.ciiva.com/7670/1533075-7670379.pdf?src-supplier=Element14; ComponentLink4Description: https://datasheet.ciiva.com/7670/1533075-7670379.pdf?src-supplier=Element14; ComponentLink5URL: https://datasheet.ciiva.com/2496/dcrcwe3-2496040.pdf?src-supplier=Digi-Key; ComponentLink5Description: https://datasheet.ciiva.com/2496/dcrcwe3-2496040.pdf?src-supplier=Digi-Key; ComponentLink6URL: https://datasheet.ciiva.com/2496/dcrcwe3-2496041.pdf?src-supplier=Digi-Key; ComponentLink6Description: https://datasheet.ciiva.com/2496/dcrcwe3-2496041.pdf?src-supplier=Digi-Key; ComponentLink7URL: https://datasheet.ciiva.com/2496/dcrcwe3-2496042.pdf?src-supplier=Digi-Key; ComponentLink7Description: https://datasheet.ciiva.com/2496/dcrcwe3-2496042.pdf?src-supplier=Digi-Key; ComponentLink8URL: https://datasheet.ciiva.com/9080/dcrcwe3-9080725.pdf?src-supplier=Avnet; ComponentLink8Description: https://datasheet.ciiva.com/9080/dcrcwe3-9080725.pdf?src-supplier=Avnet
R304 R311 R312 = CMP-2000-06960-1: Chip Resistor, 330 Ohm, +/- 1%, 125 mW, -55 to 155 degC, 0805 (2012 Metric), RoHS, Tape and Reel; Manufacturer: Yageo; Manufacturer Part Number: CRCW0805330RFKEA; Voltage Rating: 150V; Temperature Coefficient: 100PPM/C; Power Rating: 125mW(1/8W); Max Power Dissipation: 125mW; Value: 330R; Datasheet Version: Rev. 7, 05/2017; Termination Style: SMD/SMT; Case Code - mm: 2012; Package Description: 2-Pin Surface Mounted Device, Body 2 x 1.25 mm; Operating Temperature Range: -55Cto+155C; Case Code - in: 0805; Packaging: Reel; Tolerance: 1%; Package Reference: 0805; Mounting Technology: SurfaceMount; Product: ThickFilmResistorsGeneralPurpose; Series: RC; Manufacturer URL: http://www.yageo.com/; Datasheet URL: http://www.yageo.com/documents/recent/PYu-RC_Group_51_RoHS_L_7.pdf; Supplier 1: Digi-Key; Supplier Part Number 1: 311-330CRCT-ND; Manufacturer 1: Yageo; Manufacturer Part Number 1: RC0805FR-07330RL; RoHS: Yes; Category: Chip SMD Resistors; Stock 1: 1297787; Pricing 1: 1=0.10000, 10=0.03700, 100=0.01510, 1000=0.00680, 2500=0.00590 (USD); Case/Package: 0805; Case Code (Imperial): 0805; Case Code (Metric): 2012; Size Code: 0805; Min Operating Temperature: -55°C; Max Operating Temperature: 155°C; Package Quantity: 5000; Termination: SMD/SMT; Construction: Rectangular; Resistor Type: Thick Film; Number of Terminations: 2; Features: Moisture Resistant; Resistance Tolerance: 1%; Length: 0.079inch; Width: 0.049inch; Height: 0.024inch; Depth: 1.25mm; RoHS Compliant: Yes; Military Standard: Not; Lead Free: Lead Free; ComponentLink1URL: https://datasheet.ciiva.com/2457/pyu-r-int-thick-7-2457015.pdf?src-supplier=Digi-Key; ComponentLink1Description: https://datasheet.ciiva.com/2457/pyu-r-int-thick-7-2457015.pdf?src-supplier=Digi-Key; ComponentLink2URL: https://datasheet.ciiva.com/2457/pyu-r-int-thick-7-2457016.pdf?src-supplier=Digi-Key; ComponentLink2Description: https://datasheet.ciiva.com/2457/pyu-r-int-thick-7-2457016.pdf?src-supplier=Digi-Key; ComponentLink3URL: https://datasheet.ciiva.com/2457/pyu-r-int-thick-7-2457014.pdf?src-supplier=Digi-Key; ComponentLink3Description: https://datasheet.ciiva.com/2457/pyu-r-int-thick-7-2457014.pdf?src-supplier=Digi-Key; ComponentLink4URL: https://datasheet.ciiva.com/12667/rc0805-12667925.pdf?src-supplier=Mouser; ComponentLink4Description: https://datasheet.ciiva.com/12667/rc0805-12667925.pdf?src-supplier=Mouser; ComponentLink5URL: https://datasheet.ciiva.com/7941/444164-7941768.pdf?src-supplier=Element14; ComponentLink5Description: https://datasheet.ciiva.com/7941/444164-7941768.pdf?src-supplier=Element14; ComponentLink6URL: https://datasheet.ciiva.com/7941/444164-7941769.pdf?src-supplier=Element14; ComponentLink6Description: https://datasheet.ciiva.com/7941/444164-7941769.pdf?src-supplier=Element14; ComponentLink7URL: https://datasheet.ciiva.com/16740/rc0805-16740975.pdf?src-supplier=Future+Electronics; ComponentLink7Description: https://datasheet.ciiva.com/16740/rc0805-16740975.pdf?src-supplier=Future+Electronics; Supplier: Newark; Supplier Part Number: 53K0164; Stock: 218356; Pricing: 1=0.02, 25=0.02, 50=0.02, 100=0.02 (USD); Contact Plating: Tin; Weight: 0.000194oz; Voltage Rating (DC): 150V; Ratings: AEC-Q200; Reach SVHC Compliant: Unknown; ComponentLink8URL: https://datasheet.ciiva.com/8944/dcrcwe3-8944773.pdf?src-supplier=Avnet; ComponentLink8Description: https://datasheet.ciiva.com/8944/dcrcwe3-8944773.pdf?src-supplier=Avnet; ComponentLink9URL: https://datasheet.ciiva.com/8944/dcrcwe3-8944776.pdf?src-supplier=Avnet; ComponentLink9Description: https://datasheet.ciiva.com/8944/dcrcwe3-8944776.pdf?src-supplier=Avnet; ComponentLink10URL: https://datasheet.ciiva.com/7777/1697337-7777390.pdf?src-supplier=Element14; ComponentLink10Description: https://datasheet.ciiva.com/7777/1697337-7777390.pdf?src-supplier=Element14; ComponentLink11URL: https://datasheet.ciiva.com/16769/70201119-16769852.pdf?src-supplier=Allied+Electronics; ComponentLink11Description: https://datasheet.ciiva.com/16769/70201119-16769852.pdf?src-supplier=Allied+Electronics
R305 = RES_0805_K_030.00: Res Thick Film 0805 30K Ohm 1% 0.125W(1/8W) ±100ppm/°C Pad SMD Automotive T/R; Manufacturer 1: Panasonic; Manufacturer Part Number 1: ERJ-6ENF3002V; Power Rating: 125mW; Voltage Rating: 150V; Supplier 1: Digi-Key; Supplier Part Number 1: P30.0KCCT-ND; RoHS: Yes; Category: Chip SMD Resistors; Stock 1: 296893; Pricing 1: 1=0.10000, 10=0.07500, 100=0.02880, 1000=0.01265, 2500=0.01092 (USD); Mount: Surface Mount; Case/Package: 0805; Case Code (Metric): 2012; Case Code (Imperial): 0805; Contact Plating: Tin; Weight: 0.000194oz; Min Operating Temperature: -55°C; Max Operating Temperature: 155°C; Tolerance: 1%; Packaging: Tape and Reel; Package Quantity: 1; Resistor Type: Thick Film; Number of Terminations: 2; Termination: SMD/SMT; Temperature Coefficient: 100ppm/°C; Max Power Dissipation: 125mW; Voltage Rating (DC): 150V; Features: Automotive AEC-Q200; Series: ERJ; Technology: THICK FILM; Resistance Tolerance: 1%; Construction: Rectangular; Length: 2mm; Width: 0.049inch; Height: 0.6mm; Depth: 1.25mm; Radiation Hardening: No; REACH SVHC: Unknown; Military Standard: Not; Lead Free: Lead Free; RoHS Compliant: Yes; ComponentLink1URL: https://datasheet.ciiva.com/11821/0900766b80f80784-11821600.pdf?src-supplier=RSComponents; ComponentLink1Description: https://datasheet.ciiva.com/11821/0900766b80f80784-11821600.pdf?src-supplier=RSComponents; ComponentLink2URL: https://datasheet.ciiva.com/9117/aoa0000ce2-9117485.pdf?src-supplier=Avnet; ComponentLink2Description: https://datasheet.ciiva.com/9117/aoa0000ce2-9117485.pdf?src-supplier=Avnet; ComponentLink3URL: https://datasheet.ciiva.com/24124/aoa0000ce2-24124393.pdf?src-supplier=Mouser; ComponentLink3Description: https://datasheet.ciiva.com/24124/aoa0000ce2-24124393.pdf?src-supplier=Mouser; ComponentLink4URL: https://datasheet.ciiva.com/30169/aoa0000ce2-30169447.pdf?src-supplier=Onlinecomponents.com; ComponentLink4Description: https://datasheet.ciiva.com/30169/aoa0000ce2-30169447.pdf?src-supplier=Onlinecomponents.com; ComponentLink5URL: https://datasheet.ciiva.com/17210/aoa0000ce2-17210478.pdf?src-supplier=Avnet+Europe; ComponentLink5Description: https://datasheet.ciiva.com/17210/aoa0000ce2-17210478.pdf?src-supplier=Avnet+Europe; ComponentLink6URL: https://datasheet.ciiva.com/22673/1678782-22673293.pdf?src-supplier=Element14; ComponentLink6Description: https://datasheet.ciiva.com/22673/1678782-22673293.pdf?src-supplier=Element14; ComponentLink7URL: https://datasheet.ciiva.com/28565/1694929-28565193.pdf?src-supplier=Element14; ComponentLink7Description: https://datasheet.ciiva.com/28565/1694929-28565193.pdf?src-supplier=Element14; ComponentLink8URL: https://datasheet.ciiva.com/46441/1678782-46441405.pdf?src-supplier=Element14; ComponentLink8Description: https://datasheet.ciiva.com/46441/1678782-46441405.pdf?src-supplier=Element14; ComponentLink9URL: https://datasheet.ciiva.com/46441/1678782-46441406.pdf?src-supplier=Element14; ComponentLink9Description: https://datasheet.ciiva.com/46441/1678782-46441406.pdf?src-supplier=Element14; ComponentLink10URL: https://datasheet.ciiva.com/16512/aoa0000ce2-16512236.pdf?src-supplier=Avnet+Asia; ComponentLink10Description: https://datasheet.ciiva.com/16512/aoa0000ce2-16512236.pdf?src-supplier=Avnet+Asia; ComponentLink11URL: https://datasheet.ciiva.com/7711/1678782-7711062.pdf?src-supplier=Element14; ComponentLink11Description: https://datasheet.ciiva.com/7711/1678782-7711062.pdf?src-supplier=Element14; Resistance: 30K
SW300 = JS202011SCQN: C & K COMPONENTS - JS202011SCQN - SWITCH, DPDT, 0.6A, 6VDC, SMD; Manufacturer 1: ITT C&K; Actuator Material: Nylon,Polyamide,PA46; Actuator Color: Black; Voltage Rating (DC): 6V; Current Rating: 300mA; Electrical Life: 5000Cycles; Switch Function: On-On; Contact Resistance: 70mR; Switch Travel: 2mm; Actuator Type: Standard; Supplier 1: Digi-Key; Supplier Part Number 1: 401-2002-1-ND; Manufacturer Part Number 1: JS202011SCQN; RoHS: Yes; Category: Slide Switches; Stock 1: 21096; Pricing 1: 1=0.55000, 10=0.53000, 25=0.51040, 100=0.44180, 250=0.40252, 500=0.37306 (USD); Mount: Surface Mount; Contact Plating: Silver; Contact Material: Copper Alloy; Housing Material: Nylon; Min Operating Temperature: -20°C; Max Operating Temperature: 85°C; Throw Configuration: DPDT; Packaging: Tape and Reel; Package Quantity: 1; Termination: Gull Wing; Max Voltage Rating (DC): 6V; Series: JS; Max Current Rating: 300mA; Contact Current Rating: 300mA; Orientation: Vertical; Length: 9mm; Depth: 7.5mm; Actuator Length: 2mm; Radiation Hardening: No; REACH SVHC: No SVHC; Lead Free: Lead Free; Flammability Rating: UL94 V-2; ComponentLink1URL: https://datasheet.ciiva.com/2889/js-29aug13-2889127.pdf?src-supplier=Digi-Key; ComponentLink1Description: https://datasheet.ciiva.com/2889/js-29aug13-2889127.pdf?src-supplier=Digi-Key; ComponentLink2URL: https://datasheet.ciiva.com/23829/1707718-23829488.pdf?src-supplier=Newark; ComponentLink2Description: https://datasheet.ciiva.com/23829/1707718-23829488.pdf?src-supplier=Newark; ComponentLink3URL: https://datasheet.ciiva.com/8625/js-9dec14-8625470.pdf?src-supplier=Avnet; ComponentLink3Description: https://datasheet.ciiva.com/8625/js-9dec14-8625470.pdf?src-supplier=Avnet; ComponentLink4URL: https://datasheet.ciiva.com/2889/js-15sept15-2889128.pdf?src-supplier=Digi-Key; ComponentLink4Description: https://datasheet.ciiva.com/2889/js-15sept15-2889128.pdf?src-supplier=Digi-Key; ComponentLink5URL: https://datasheet.ciiva.com/2889/js-15sept15-2889129.pdf?src-supplier=Digi-Key; ComponentLink5Description: https://datasheet.ciiva.com/2889/js-15sept15-2889129.pdf?src-supplier=Digi-Key; ComponentLink6URL: https://datasheet.ciiva.com/22630/1707718-22630697.pdf?src-supplier=Element14; ComponentLink6Description: https://datasheet.ciiva.com/22630/1707718-22630697.pdf?src-supplier=Element14
SW301 SW302 = CMP-2000-05602-2: Swicth, SPST, 24 V, -35 to 85 degC, 4-Pin SMD, RoHS, Tape and Reel; Manufacturer: TE Connectivity; Switch Travel: 0.25mm; Mechanical Life: 100000Cycles; Contact Current Rating: 50mA; Operating Force: 1.57N; Actuator Material: Polyamide; Contact Resistance: 100mOhm; Voltage Rating: 24V; Illumination Type: Illuminated; Actuator Length: 0.055inch; Max Voltage Rating (DC): 12V; Case\/Package: SMD/SMT; Switch Function: Off-Mom; Actuator Type: Standard; Insulation Resistance: 100MR; Orientation: Straight; Datasheet URL: http://www.te.com/commerce/DocumentDelivery/DDEController?Action=showdoc&DocId=Customer+Drawing%7F2-1437565-7%7FV%7Fpdf%7FEnglish%7FENG_CD_2-1437565-7_V.pdf%7F4-1437565-2; Min Operating Temperature: -35degC; Packaging: LoosePiece; Termination: GullWing; Throw Configuration: SPST; Package Description: 4-Pin Surface Mount Device, Body 6 x 6 mm, Pitch 4.5 mm; Mounting Technology: SurfaceMount; Contact Plating: Silver; Datasheet Version: Rev. V, 02/2015; RoHSCompliant: true; Max Operating Temperature: 85degC; Length: 6mm; Voltage Rating (DC): 24V; Electrical Life: 100000Cycles; Current Rating: 50mA; Package Quantity: 750; Mount: SurfaceMount; Package Reference: FSM4JSMA; Manufacturer URL: http://www.te.com/; Width: 6mm; REACH SVHC: Unknown; Contact Material: CopperAlloy; Supplier 1: Digi-Key; Supplier Part Number 1: 450-1129-ND; Manufacturer 1: TE Connectivity; Manufacturer Part Number 1: FSM4JSMA; RoHS: Yes; Category: Pushbutton Switches; Stock 1: 65608; Pricing 1: 1=0.27000, 10=0.26300, 25=0.24960, 100=0.22600, 250=0.20604, 750=0.19152, 1500=0.16339, 3000=0.15885, 5250=0.14977 (USD); Case/Package: SMD/SMT; Color: Black; Series: FSMJSMA; Max Current Rating: 50mA; Depth: 10mm; Radiation Hardening: No; RoHS Compliant: Yes; Lead Free: Lead Free; ELV: Compliant; Supplier: Newark; Supplier Part Number: 27AC5877; Manufacturer Part Number: FSM4JSMA; Stock: 46743; Pricing: 1=0.292, 10=0.274, 25=0.255, 100=0.232, 500=0.2, 1000=0.166 (USD); Reach SVHC Compliant: Unknown